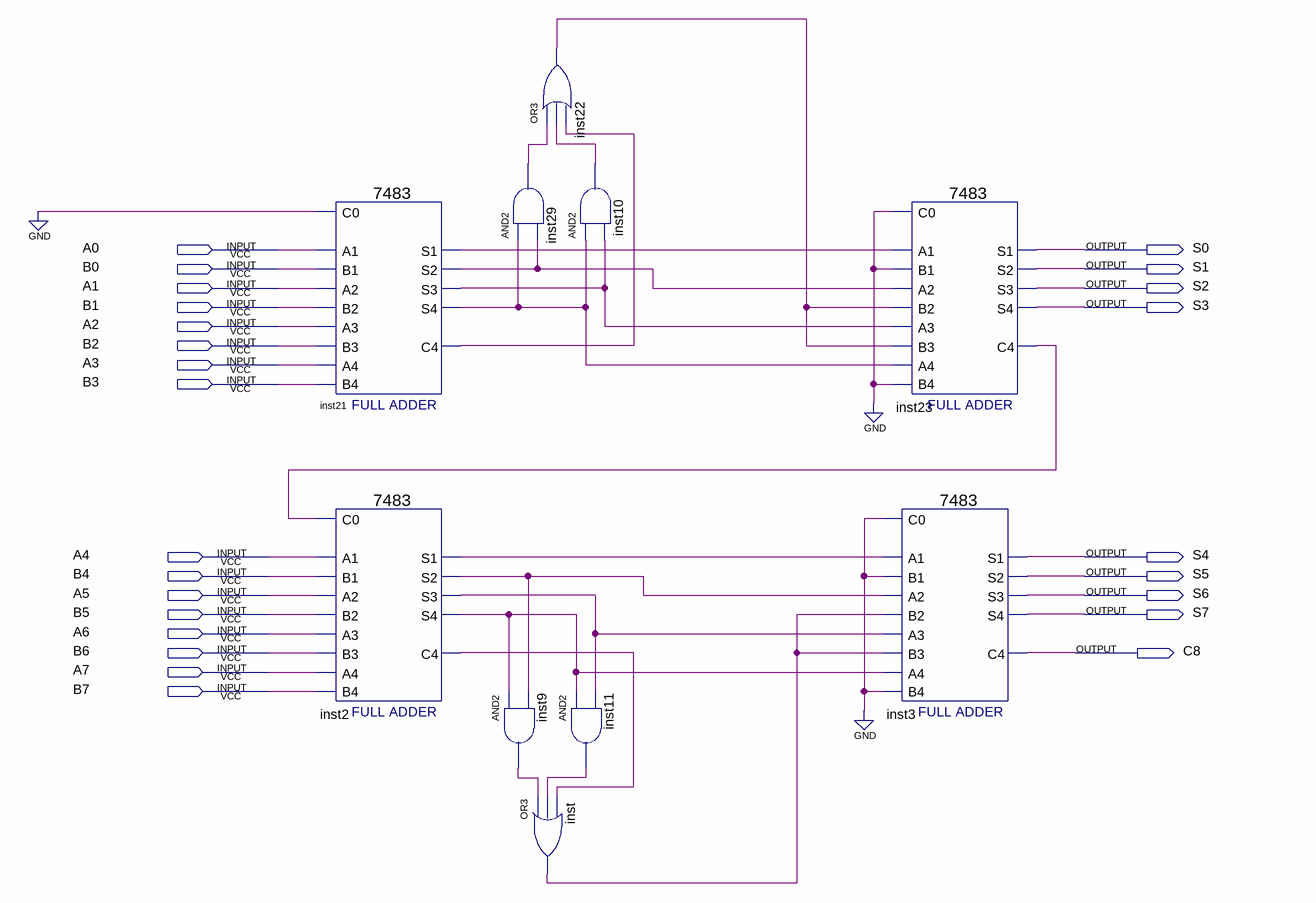
[diagram p0: schematic sheet]
// Quartus schematic bcd.bdf as structural Verilog: 10 symbols, 25 pins
module bcd (
  input  A0,
  input  B0,
  input  A1,
  input  B1,
  input  A2,
  input  B2,
  input  A3,
  input  B3,
  input  A4,
  input  B4,
  input  A5,
  input  B5,
  input  A6,
  input  B6,
  input  A7,
  input  B7,
  output S0,
  output S1,
  output S2,
  output S3,
  output S4,
  output S5,
  output S6,
  output S7,
  output C8
);

  wire inst2_c4, inst2_s1, inst2_s2, inst2_s3, inst2_s4, inst9_out, inst10_out, inst11_out, inst21_c4,
       inst21_s1, inst21_s2, inst21_s3, inst21_s4, inst22_out, inst23_c4, inst29_out, inst_out;

  \7483  inst21 (
    .B4(B3), .C0(1'b0), .A1(A0), .A2(A1), .B1(B0), .B2(B1), .A3(A2), .B3(B2), .A4(A3), .S3(inst21_s3),
    .S4(inst21_s4), .S2(inst21_s2), .C4(inst21_c4), .S1(inst21_s1));
  \7483  inst2 (
    .B4(B7), .C0(inst23_c4), .A1(A4), .A2(A5), .B1(B4), .B2(B5), .A3(A6), .B3(B6), .A4(A7), .S3(inst2_s3),
    .S4(inst2_s4), .S2(inst2_s2), .C4(inst2_c4), .S1(inst2_s1));
  or inst22 (inst22_out, inst29_out, inst10_out, inst21_c4);
  and inst29 (inst29_out, inst21_s4, inst21_s2);
  and inst9 (inst9_out, inst2_s4, inst2_s2);
  and inst11 (inst11_out, inst2_s4, inst2_s3);
  or inst (inst_out, inst9_out, inst11_out, inst2_c4);
  and inst10 (inst10_out, inst21_s4, inst21_s3);
  \7483  inst23 (
    .B4(1'b0), .C0(1'b0), .A1(inst21_s1), .A2(inst21_s2), .B1(1'b0), .B2(inst22_out), .A3(inst21_s3),
    .B3(inst22_out), .A4(inst21_s4), .S3(S2), .S4(S3), .S2(S1), .C4(inst23_c4), .S1(S0));
  \7483  inst3 (
    .B4(1'b0), .C0(1'b0), .A1(inst2_s1), .A2(inst2_s2), .B1(1'b0), .B2(inst_out), .A3(inst2_s3),
    .B3(inst_out), .A4(inst2_s4), .S3(S6), .S4(S7), .S2(S5), .C4(C8), .S1(S4));
endmodule
